# Altium schematic sheet projet_pcb_etu_formatA4.SchDoc
size 508 x 281 mm; Organization: Altium Limited; PageSetup: Record=PageOptions|CenterHorizontal=True|CenterVertical=True|PrintScale=0.58|XCorrection=1.00|YCorrection=1.00|PrintKind=1|BorderSize=5000000|LeftOffset=0|BottomOffset=0|Orientation=2|PaperLength=1000|PaperWidth=1000|Scale=100|PaperSource=7|PrintQuality=-4|MediaType=1|DitherType=10|PrintScaleMode=1|PaperKind=Lettre (8,5 x 11 po.)|PaperIndex=9
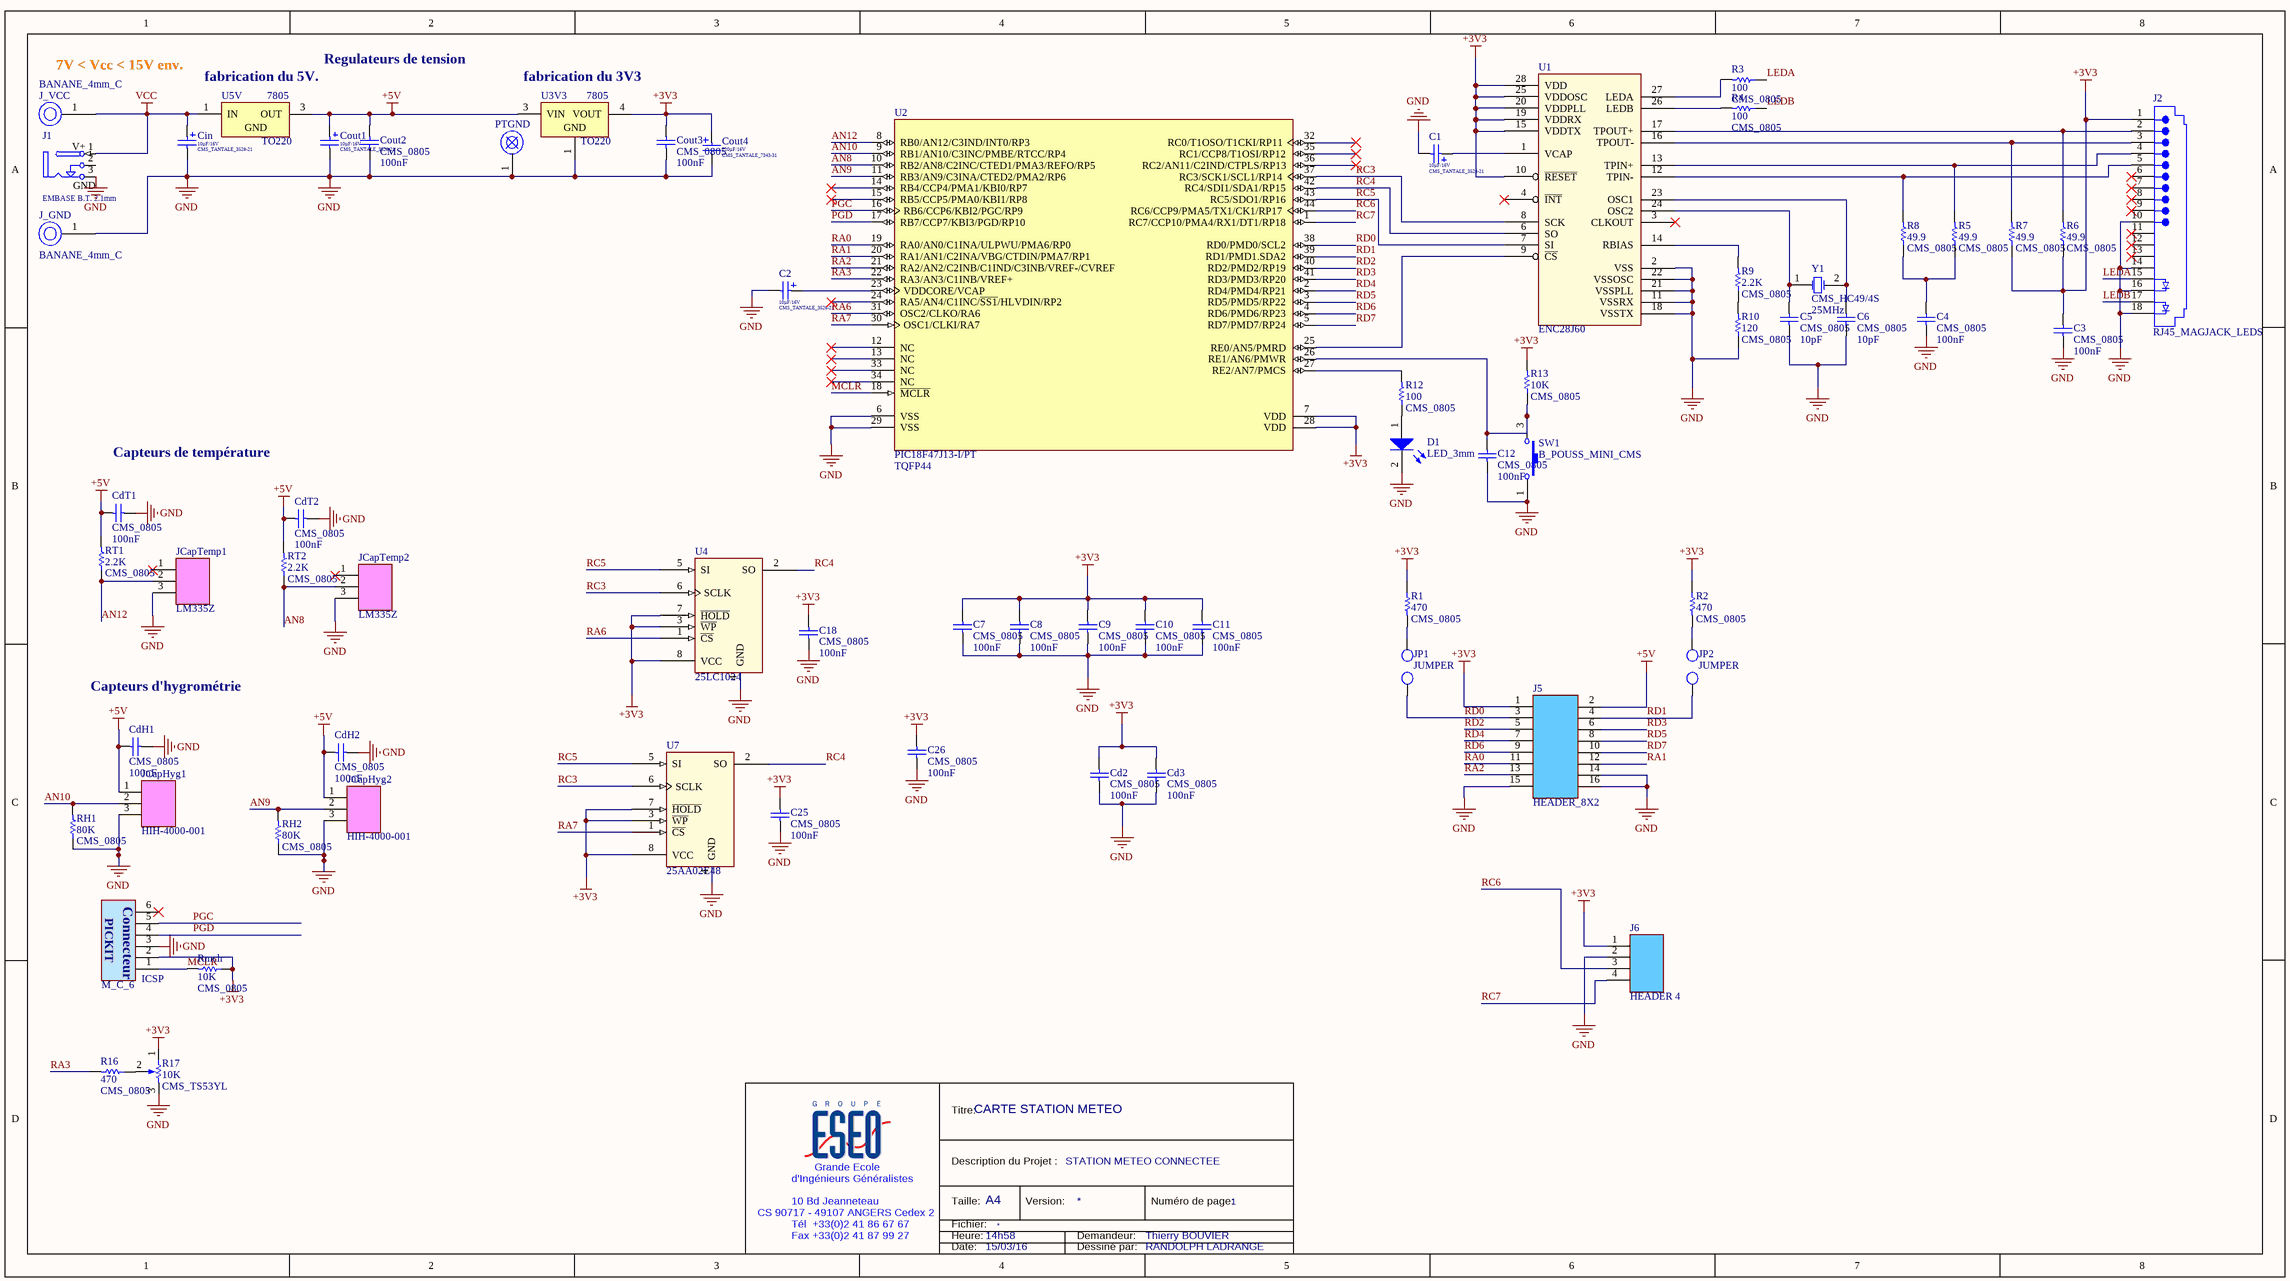
[diagram p0: projet_pcb_etu_formatA4.SchDoc]

## Parts
C1  value 10µF/16V  Type: CMS_TANTALE_3528-21  [CONDENSATEUR_CMS_POLARISE_TANTALE_B/3528-21]  (hidden comment: CMS_POLARISE_TANTALE_3528-21)
C2  value 10µF/16V  Type: CMS_TANTALE_3528-21  [CONDENSATEUR_CMS_POLARISE_TANTALE_B/3528-21]  (hidden comment: CMS_POLARISE_TANTALE_3528-21)
C3  value 100nF  [CONDENSATEUR_CMS_0805]  (hidden comment: CMS_0805)
C4  value 100nF  [CONDENSATEUR_CMS_0805]  (hidden comment: CMS_0805)
C5  value 10pF  [CONDENSATEUR_CMS_0805]  (hidden comment: CMS_0805)
C6  value 10pF  [CONDENSATEUR_CMS_0805]  (hidden comment: CMS_0805)
C7  value 100nF  [CONDENSATEUR_CMS_0805]  (hidden comment: CMS_0805)
C8  value 100nF  [CONDENSATEUR_CMS_0805]  (hidden comment: CMS_0805)
C9  value 100nF  [CONDENSATEUR_CMS_0805]  (hidden comment: CMS_0805)
C10  value 100nF  [CONDENSATEUR_CMS_0805]  (hidden comment: CMS_0805)
C11  value 100nF  [CONDENSATEUR_CMS_0805]  (hidden comment: CMS_0805)
C12  value 100nF  [CONDENSATEUR_CMS_0805]  (hidden comment: CMS_0805)
C18  value 100nF  [CONDENSATEUR_CMS_0805]  (hidden comment: CMS_0805)
C25  value 100nF  [CONDENSATEUR_CMS_0805]  (hidden comment: CMS_0805)
C26  value 100nF  [CONDENSATEUR_CMS_0805]  (hidden comment: CMS_0805)
Cd2  value 100nF  [CONDENSATEUR_CMS_0805]  (hidden comment: CMS_0805)
Cd3  value 100nF  [CONDENSATEUR_CMS_0805]  (hidden comment: CMS_0805)
CdH1  value 100nF  [CONDENSATEUR_CMS_0805]  (hidden comment: CMS_0805)
CdH2  value 100nF  [CONDENSATEUR_CMS_0805]  (hidden comment: CMS_0805)
CdT1  value 100nF  [CONDENSATEUR_CMS_0805]  (hidden comment: CMS_0805)
CdT2  value 100nF  [CONDENSATEUR_CMS_0805]  (hidden comment: CMS_0805)
Cin  value 10µF/16V  Type: CMS_TANTALE_3528-21  [CONDENSATEUR_CMS_POLARISE_TANTALE_B/3528-21]  (hidden comment: CMS_POLARISE_TANTALE_3528-21)
Cout1  value 10µF/16V  Type: CMS_TANTALE_3528-21  [CONDENSATEUR_CMS_POLARISE_TANTALE_B/3528-21]  (hidden comment: CMS_POLARISE_TANTALE_3528-21)
Cout2  value 100nF  [CONDENSATEUR_CMS_0805]  (hidden comment: CMS_0805)
Cout3  value 100nF  [CONDENSATEUR_CMS_0805]  (hidden comment: CMS_0805)
Cout4  value 220µF/16V  Type: CMS_TANTALE_7343-31  [CONDENSATEUR_CMS_POLARISE_TANTALE_D/7343-31]  (hidden comment: CMS_POLARISE_TANTALE_7343-31)
D1  LED_3MM  [LED_3MM]
ICSP  Type: M_C_6  [BARRETTE_6_M_C]  (hidden comment: BARRETTE_6 CONTACTS_1 RANGEE_MALE_COUDEE)
J1  Type: EMBASE B.T. 2.1mm  [EMBASE_BASSE_TENSION_2.1mm]  (hidden comment: EMBASE_BASSE_TENSION_2.1mm)
J2  RJ45_MAGJACK_LEDS  [RJ45_MAGJACK_LED]
J5  Type: HEADER_8X2  [BARRETTE_8X2_M_D]  (hidden comment: BARRETTE_8 CONTACTS_2 RANGEES_MALE_DROITE)
J6  Type: HEADER 4  [BARRETTE_4_M_D]  (hidden comment: BARRETTE_4 CONTACTS_1 RANGEE_MALE_DROITE)
J_GND  Type: BANANE_4mm_C  [DOUILLE_BANANE_4MM_COUDEE]  (hidden comment: DOUILLE BANANE 4mm COUDEE)
J_VCC  Type: BANANE_4mm_C  [DOUILLE_BANANE_4MM_COUDEE]  (hidden comment: DOUILLE BANANE 4mm COUDEE)
JCapHyg1  Type: HIH-4000-001  [BARRETTE_3_F_D]  (hidden comment: BARRETTE 3 CONTACTS 1 RANGEE FEMELLE DROITE)
JCapHyg2  Type: HIH-4000-001  [BARRETTE_3_F_D]  (hidden comment: BARRETTE 3 CONTACTS 1 RANGEE FEMELLE DROITE)
JCapTemp1  Type: LM335Z  [BARRETTE_3_F_D]  (hidden comment: BARRETTE 3 CONTACTS 1 RANGEE FEMELLE DROITE)
JCapTemp2  Type: LM335Z  [BARRETTE_3_F_D]  (hidden comment: BARRETTE 3 CONTACTS 1 RANGEE FEMELLE DROITE)
JP1  Type: JUMPER  [BARRETTE_2_M_D]  (hidden comment: JUMPER2)
JP2  Type: JUMPER  [BARRETTE_2_M_D]  (hidden comment: JUMPER2)
PTGND  POINT_TEST  [POINT_TEST]  (value not drawn)
R1  value 470  Type: CMS_0805  [RESISTANCE_CMS_0805]  (hidden comment: RESISTANCE_CMS_0805)
R2  value 470  Type: CMS_0805  [RESISTANCE_CMS_0805]  (hidden comment: RESISTANCE_CMS_0805)
R3  value 100  Type: CMS_0805  [RESISTANCE_CMS_0805]  (hidden comment: RESISTANCE_CMS_0805)
R4  value 100  Type: CMS_0805  [RESISTANCE_CMS_0805]  (hidden comment: RESISTANCE_CMS_0805)
R5  value 49.9  Type: CMS_0805  [RESISTANCE_CMS_0805]  (hidden comment: RESISTANCE_CMS_0805)
R6  value 49.9  Type: CMS_0805  [RESISTANCE_CMS_0805]  (hidden comment: RESISTANCE_CMS_0805)
R7  value 49.9  Type: CMS_0805  [RESISTANCE_CMS_0805]  (hidden comment: RESISTANCE_CMS_0805)
R8  value 49.9  Type: CMS_0805  [RESISTANCE_CMS_0805]  (hidden comment: RESISTANCE_CMS_0805)
R9  value 2.2K  Type: CMS_0805  [RESISTANCE_CMS_0805]  (hidden comment: RESISTANCE_CMS_0805)
R10  value 120  Type: CMS_0805  [RESISTANCE_CMS_0805]  (hidden comment: RESISTANCE_CMS_0805)
R12  value 100  Type: CMS_0805  [RESISTANCE_CMS_0805]  (hidden comment: RESISTANCE_CMS_0805)
R13  value 10K  Type: CMS_0805  [RESISTANCE_CMS_0805]  (hidden comment: RESISTANCE_CMS_0805)
R16  value 470  Type: CMS_0805  [RESISTANCE_CMS_0805]  (hidden comment: RESISTANCE_CMS_0805)
R17  value 10K  Type: CMS_TS53YL  [TRIMMER_CMS_TS53YL]  (hidden comment: RESISTANCE_VARIABLE_CMS : TS53YL)
RH1  value 80K  Type: CMS_0805  [RESISTANCE_CMS_0805]  (hidden comment: RESISTANCE_CMS_0805)
RH2  value 80K  Type: CMS_0805  [RESISTANCE_CMS_0805]  (hidden comment: RESISTANCE_CMS_0805)
Rmclr  value 10K  Type: CMS_0805  [RESISTANCE_CMS_0805]  (hidden comment: RESISTANCE_CMS_0805)
RT1  value 2.2K  Type: CMS_0805  [RESISTANCE_CMS_0805]  (hidden comment: RESISTANCE_CMS_0805)
RT2  value 2.2K  Type: CMS_0805  [RESISTANCE_CMS_0805]  (hidden comment: RESISTANCE_CMS_0805)
SW1  Type: B_POUSS_MINI_CMS  [BOUTON_POUSS_CMS]  (hidden comment: BOUTON_POUSSOIR_MINIATURE_CMS)
U1  ENC28J60  [SOIC28_PAS=1.27_LARG=10.3_LONG=18]
U2  Type: PIC18F47J13-I/PT  Package: TQFP44  [TQFP44_PAS=0.8_LARG=12_LONG=12]  (hidden comment: PIC18F47J13-I/PT_TQFP44)
U3V3  Type: 7805  Package: TO220  [TO-252]  (hidden comment: REGULATEUR_TO220_78XX)
U4  25LC1024  [SOP8_PAS=1.27_LARG=6_LONG=5.2]
U5V  Type: 7805  Package: TO220  [TO-252]  (hidden comment: REGULATEUR_TO220_78XX)
U7  25AA02E48  [SOIC8_PAS=1.27_LARG=4_LONG=5]
Y1  value 25MHz  Type: CMS_HC49/4S  [QUARTZ_CMS_HC49/4S]  (hidden comment: QUARTZ_CMS_HC49/4S)

## Nets
+3V3: C3.1 C7.1 C8.1 C9.1 C10.1 C11.1 C18.2 C25.2 C26.2 Cd2.1 Cd3.1 Cout3.1 Cout4.1 ICSP.2 J2.1 J5.1 J6.1 R1.1 R2.1 R6.1 R7.1 R13.2 R17.1 Rmclr.1 U1.10(~{RESET}) U1.15(VDDTX) U1.19(VDDRX) U1.20(VDDPLL) U1.25(VDDOSC) U1.28(VDD) U2.7(VDD) U2.28(VDD) U3V3.4(VOUT) U4.3(~{WP}) U4.7(~{HOLD}) U4.8(VCC) U7.3(~{WP}) U7.7(~{HOLD}) U7.8(VCC)
+5V: CdH1.1 CdH2.1 CdT1.1 CdT2.1 Cout1.1 Cout2.1 J5.2 JCapHyg1.1 JCapHyg2.1 RT1.2 RT2.2 U3V3.3(VIN) U5V.3(OUT)
GND: C1.2 C2.2 C3.2 C4.2 C5.2 C6.2 C7.2 C8.2 C9.2 C10.2 C11.2 C12.2 C18.1 C25.1 C26.1 Cd2.2 Cd3.2 CdH1.2 CdH2.2 CdT1.2 CdT2.2 Cin.2 Cout1.2 Cout2.2 Cout3.2 Cout4.2 D1.2 ICSP.3 J1.3 J2.10 J2.14 J2.16 J2.18 J5.14 J5.15 J5.16 J6.2 J_GND.1 JCapHyg1.3 JCapHyg2.3 JCapTemp1.3 JCapTemp2.3 PTGND.1 R10.1 R17.3 RH1.1 RH2.1 SW1.1 U1.2(VSS) U1.11(VSSRX) U1.18(VSSTX) U1.21(VSSPLL) U1.22(VSSOSC) U2.6(VSS) U2.29(VSS) U3V3.1(GND) U4.4(GND) U7.4(GND)
VCC: Cin.1 J1.1 J_VCC.1 U5V.1(IN)
AN8: JCapTemp2.2 RT2.1 U2.10(RB2/AN8/C2INC/CTED1/PMA3/REFO/RP5)
AN9: JCapHyg2.2 RH2.2 U2.11(RB3/AN9/C3INA/CTED2/PMA2/RP6)
AN10: JCapHyg1.2 RH1.2 U2.9(RB1/AN10/C3INC/PMBE/RTCC/RP4)
AN12: JCapTemp1.2 RT1.1 U2.8(RB0/AN12/C3IND/INT0/RP3)
LEDA: J2.15 R3.1
LEDB: J2.17 R4.1
MCLR: ICSP.1 Rmclr.2 U2.18(~{MCLR})
PGC: ICSP.5 U2.16(RB6/CCP6/KBI2/PGC/RP9)
PGD: ICSP.4 U2.17(RB7/CCP7/KBI3/PGD/RP10)
RA0: J5.11 U2.19(RA0/AN0/C1INA/ULPWU/PMA6/RP0)
RA1: J5.12 U2.20(RA1/AN1/C2INA/VBG/CTDIN/PMA7/RP1)
RA2: J5.13 U2.21(RA2/AN2/C2INB/C1IND/C3INB/VREF-/CVREF)
RA3: R16.2 U2.22(RA3/AN3/C1INB/VREF+)
RA6: U2.31(OSC2/CLKO/RA6) U4.1(~{CS})
RA7: U2.30(OSC1/CLKI/RA7) U7.1(~{CS})
RC3: U1.8(SCK) U2.37(RC3/SCK1/SCL1/RP14) U4.6(SCLK) U7.6(SCLK)
RC4: U1.6(SO) U2.42(RC4/SDI1/SDA1/RP15) U4.2(SO) U7.2(SO)
RC5: U1.7(SI) U2.43(RC5/SDO1/RP16) U4.5(SI) U7.5(SI)
RC6: J6.3 U2.44(RC6/CCP9/PMA5/TX1/CK1/RP17)
RC7: J6.4 U2.1(RC7/CCP10/PMA4/RX1/DT1/RP18)
RD0: J5.3 JP1.1 U2.38(RD0/PMD0/SCL2)
RD1: J5.4 JP2.1 U2.39(RD1/PMD1.SDA2)
RD2: J5.5 U2.40(RD2/PMD2/RP19)
RD3: J5.6 U2.41(RD3/PMD3/RP20)
RD4: J5.7 U2.2(RD4/PMD4/RP21)
RD5: J5.8 U2.3(RD5/PMD5/RP22)
RD6: J5.9 U2.4(RD6/PMD6/RP23)
RD7: J5.10 U2.5(RD7/PMD7/RP24)
NetC1_1: C1.1 U1.1(VCAP)
NetC2_1: C2.1 U2.23(VDDCORE/VCAP)
NetC4_1: C4.1 R5.1 R8.1
NetC5_1: C5.1 U1.24(OSC2) Y1.1(OSC1)
NetC6_1: C6.1 U1.23(OSC1) Y1.2(OSC2)
NetC12_1: C12.1 R13.1 SW1.3 U2.26(RE1/AN6/PMWR)
NetD1_1: D1.1 R12.1
NetJ2_2: J2.2 R6.2 U1.17(TPOUT+)
NetJ2_3: J2.3 R7.2 U1.16(TPOUT-)
NetJ2_4: J2.4 R5.2 U1.13(TPIN+)
NetJ2_5: J2.5 R8.2 U1.12(TPIN-)
NetJP1_2: JP1.2 R1.2
NetJP2_2: JP2.2 R2.2
NetR3_2: R3.2 U1.27(LEDA)
NetR4_2: R4.2 U1.26(LEDB)
NetR9_1: R9.1 R10.2
NetR9_2: R9.2 U1.14(RBIAS)
NetR12_2: R12.2 U2.27(RE2/AN7/PMCS)
NetR16_1: R16.1 R17.2
NetU1_9: U1.9(~{CS}) U2.25(RE0/AN5/PMRD)

Not connected (* = marked no-connect by the designer): ICSP 6*; J1 2; J2 6* 7* 8* 9* 11* 12* 13*; JCapTemp1 1*; JCapTemp2 1*; U1 3(CLKOUT)* 4(~{INT})*; U2 12(NC)* 13(NC)* 14(RB4/CCP4/PMA1/KBI0/RP7)* 15(RB5/CCP5/PMA0/KBI1/RP8)* 24(RA5/AN4/C1INC/~{SS1}/HLVDIN/RP2)* 32(RC0/T1OSO/T1CKI/RP11)* 33(NC)* 34(NC)* 35(RC1/CCP8/T1OSI/RP12)* 36(RC2/AN11/C2IND/CTPLS/RP13)*

## Notes on the sheet
- 7V < Vcc < 15V env.
- (near U5V) fabrication du 5V.
- Regulateurs de tension
- (near U3V3) fabrication du 3V3
- Capteurs de température
- Capteurs d'hygrométrie
- Titre:
- CARTE STATION METEO
- d'Ingénieurs Généralistes
- Grande Ecole
- Description du Projet :
- STATION METEO CONNECTEE
- CS 90717 - 49107 ANGERS Cedex 2
- 10 Bd Jeanneteau
- Tél  +33(0)2 41 86 67 67
- Fax +33(0)2 41 87 99 27
- Taille:
- Heure:
- Fichier:
- A4
- 14h58
- Version:
- Demandeur:
- Thierry BOUVIER
- Numéro de page:
- 1
- Date:
- 15/03/16
- Dessiné par:
- RANDOLPH LADRANGE
- (in symbol BARRETTE_6 CONTACTS_1 RANGEE_MALE_COUDEE) Connecteur; PICKIT
- (in symbol EMBASE_BASSE_TENSION_2.1mm) V+; GND
- (in symbol REGULATEUR_TO220_78XX) GND

## Library data of the parts
C1 C2 Cin Cout1 = CONDENSATEUR_CMS_POL_TANT_B_3528-21: CONDENSATEUR CMS POLARISE TANTALE BOITIER B/3528-21
C3-C12 C18 C25 C26 Cd2 Cd3 CdH1 CdH2 CdT1 CdT2 Cout2 Cout3 = CONDENSATEUR_CMS_CER_0805: CONDENSATEUR CMS CERAMIQUE 0805; Type: CMS_0805
Cout4 = CONDENSATEUR_CMS_POL_TANT_D_7343-31: CONDENSATEUR CMS POLARISE TANTALE BOITIER D/7343-31
D1 = LED_3MM: LED 3MM - ROUGE/VERTE/JAUNE; Type: LED_3mm
ICSP = BARRETTE_6 CONTACTS_1 RANGEE_MALE_COUDEE: BARRETTE 6 CONTACTS 1 RANGEE MALE COUDEE
J1 = EMBASE_BASSE_TENSION_2.1mm: EMBASE BASSE TENSION 2.1mm
J2 = RJ45_MAGJACK_LEDS: EMBASE RJ45_MAGJACK_LEDS; Type: RJ45_MAGJACK_LEDS
J6 = BARRETTE_4 CONTACTS_1 RANGEE_MALE_DROITE: BARRETTE 4 CONTACTS 1 RANGEE MALE DROITE
J_GND J_VCC = DOUILLE_BANANE_4mm_COUDEE: DOUILLE BANANE 4 mm COUDEE
JCapHyg1 JCapHyg2 JCapTemp1 JCapTemp2 = BARRETTE_3 CONTACTS_1 RANGEE_FEMELLE_DROITE
JP1 JP2 = JUMPER2: BARRETTE 2 CONTACTS 1 RANGEE MALE DROITE
PTGND = POINT_TEST: POINT TEST
R1-R10 R12 R13 R16 RH1 RH2 Rmclr RT1 RT2 = RESISTANCE_CMS_0805: RESISTANCE CMS 0805
R17 = RESISTANCE_VARIABLE_CMS : TS53YL: RESISTANCE VARIABLE_CMS : TS53YL
SW1 = BOUTON_POUSSOIR_MINIATURE_CMS: BOUTON POUSSOIR MINIATURE CMS ON/OFF
U2 = PIC18F47J13-I/PT_TQFP44: MICROCONTROLEUR 8 BITS - 36 I/O - 32 KO : FLASH - 16 KMOTS : MEMOIRE PROG - 4 TIMERS - 256 OCTETS : EEPROM - 1536 OCTETS : RAM - 13 CANAUX A/D 10 BITS - 40 MHz : HORLOGE - TQFP44
U3V3 U5V = REGULATEUR_TO220_78XX: REGULATEUR DE TENSION POSITIVE 78XX BOITIER TO220
Y1 = QUARTZ_CMS_HC49/4S: QUARTZ CMS HC49/4S